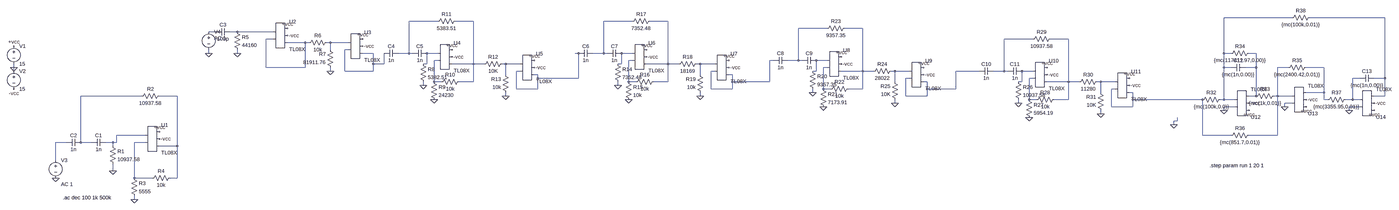
[diagram p0: schematic Filtro_Completo.asc, whole sheet]
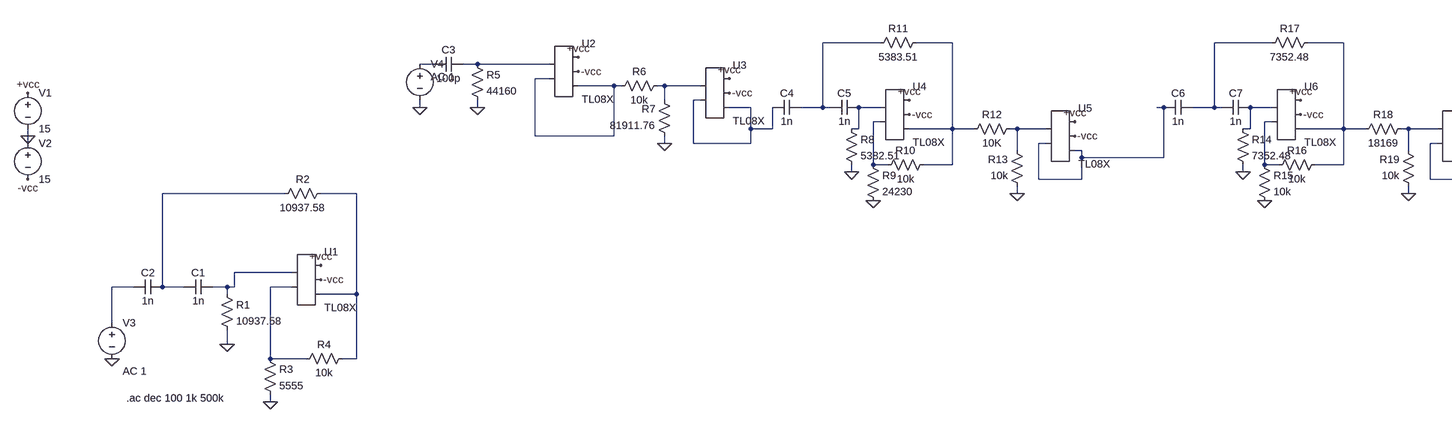
[diagram p1: schematic Filtro_Completo.asc, part, row 1 of 1, column 1 of 2]
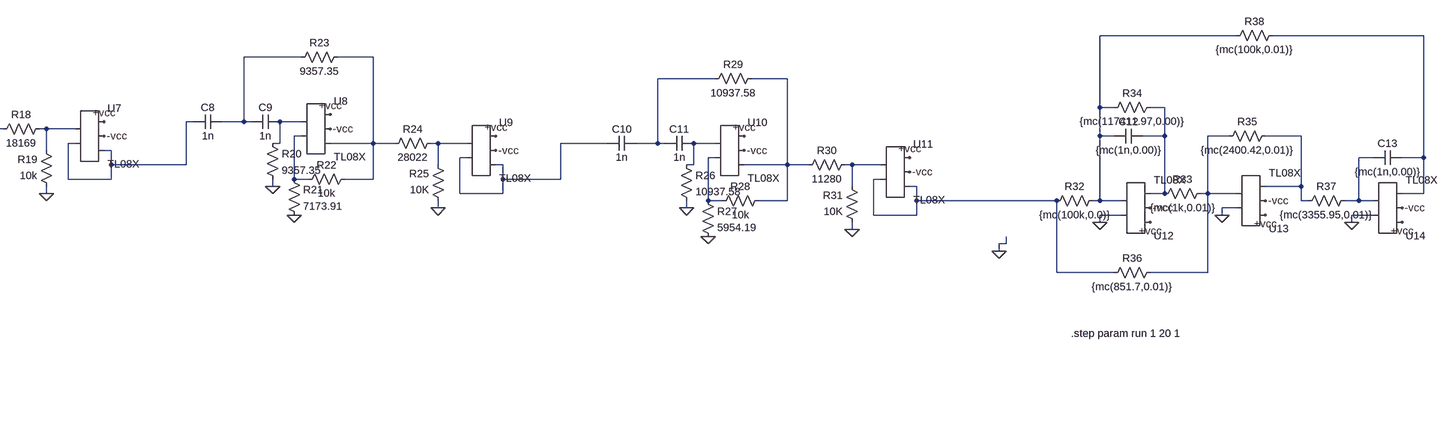
[diagram p2: schematic Filtro_Completo.asc, part, row 1 of 1, column 2 of 2]
Filtro_Completo.asc, the LTspice schematic file:
Version 4
SHEET 1 6904 680
WIRE 6256 -432 5952 -432
WIRE 6672 -432 6336 -432
WIRE 1472 -416 1344 -416
WIRE 1632 -416 1552 -416
WIRE 2464 -416 2336 -416
WIRE 2624 -416 2544 -416
WIRE 3360 -384 3232 -384
WIRE 3520 -384 3440 -384
WIRE 480 -368 448 -368
WIRE 576 -368 544 -368
WIRE 736 -368 576 -368
WIRE 736 -336 704 -336
WIRE 4352 -336 4224 -336
WIRE 4512 -336 4432 -336
WIRE 880 -320 800 -320
WIRE 896 -320 880 -320
WIRE 992 -320 976 -320
WIRE 1072 -320 992 -320
WIRE 992 -288 992 -320
WIRE 1072 -288 1056 -288
WIRE 448 -272 448 -288
WIRE 576 -272 576 -288
WIRE 1184 -272 1136 -272
WIRE 1344 -272 1344 -416
WIRE 1344 -272 1296 -272
WIRE 1360 -272 1344 -272
WIRE 1472 -272 1424 -272
WIRE 2224 -272 2208 -272
WIRE 2336 -272 2336 -416
WIRE 2336 -272 2288 -272
WIRE 2352 -272 2336 -272
WIRE 2464 -272 2416 -272
WIRE 5952 -272 5952 -432
WIRE 5984 -272 5952 -272
WIRE 6096 -272 6064 -272
WIRE 1472 -240 1456 -240
WIRE 2464 -240 2448 -240
WIRE 3120 -240 3104 -240
WIRE 3232 -240 3232 -384
WIRE 3232 -240 3184 -240
WIRE 3248 -240 3232 -240
WIRE 3360 -240 3312 -240
WIRE 1184 -224 1184 -272
WIRE 1232 -224 1232 -272
WIRE 1232 -224 1184 -224
WIRE 1424 -224 1424 -272
WIRE 1424 -224 1408 -224
WIRE 1632 -224 1632 -416
WIRE 1632 -224 1536 -224
WIRE 1680 -224 1632 -224
WIRE 1776 -224 1760 -224
WIRE 1840 -224 1776 -224
WIRE 2416 -224 2416 -272
WIRE 2416 -224 2400 -224
WIRE 2624 -224 2624 -416
WIRE 2624 -224 2528 -224
WIRE 2672 -224 2624 -224
WIRE 2768 -224 2752 -224
WIRE 2832 -224 2768 -224
WIRE -672 -208 -672 -224
WIRE 704 -208 704 -336
WIRE 880 -208 880 -320
WIRE 880 -208 704 -208
WIRE 3360 -208 3344 -208
WIRE 5952 -208 5952 -272
WIRE 5984 -208 5952 -208
WIRE 6096 -208 6096 -272
WIRE 6096 -208 6048 -208
WIRE 6240 -208 6192 -208
WIRE 6400 -208 6320 -208
WIRE -672 -192 -672 -208
WIRE 992 -192 992 -208
WIRE 1056 -192 1056 -288
WIRE 1184 -192 1184 -224
WIRE 1184 -192 1056 -192
WIRE 1840 -192 1824 -192
WIRE 2832 -192 2816 -192
WIRE 3312 -192 3312 -240
WIRE 3312 -192 3296 -192
WIRE 3520 -192 3520 -384
WIRE 3520 -192 3424 -192
WIRE 3568 -192 3520 -192
WIRE 3664 -192 3648 -192
WIRE 3728 -192 3664 -192
WIRE 4112 -192 3936 -192
WIRE 4224 -192 4224 -336
WIRE 4224 -192 4176 -192
WIRE 4240 -192 4224 -192
WIRE 4352 -192 4304 -192
WIRE 1776 -176 1776 -224
WIRE 1920 -176 1904 -176
WIRE 2768 -176 2768 -224
WIRE 2912 -176 2896 -176
WIRE 1920 -160 1920 -176
WIRE 2224 -160 2224 -272
WIRE 2224 -160 1920 -160
WIRE 3728 -160 3712 -160
WIRE 4352 -160 4336 -160
WIRE 6560 -160 6528 -160
WIRE 6672 -160 6672 -432
WIRE 6672 -160 6624 -160
WIRE 1456 -144 1456 -240
WIRE 1488 -144 1456 -144
WIRE 1632 -144 1632 -224
WIRE 1632 -144 1568 -144
WIRE 2448 -144 2448 -240
WIRE 2480 -144 2448 -144
WIRE 2624 -144 2624 -224
WIRE 2624 -144 2560 -144
WIRE 2912 -144 2912 -176
WIRE 3104 -144 3104 -240
WIRE 3104 -144 2912 -144
WIRE 3664 -144 3664 -192
WIRE 3808 -144 3792 -144
WIRE 4304 -144 4304 -192
WIRE 4304 -144 4288 -144
WIRE 4512 -144 4512 -336
WIRE 4512 -144 4416 -144
WIRE 4560 -144 4512 -144
WIRE 4656 -144 4640 -144
WIRE 4720 -144 4656 -144
WIRE 1408 -128 1408 -144
WIRE 2400 -128 2400 -144
WIRE 1824 -112 1824 -192
WIRE 1920 -112 1920 -160
WIRE 1920 -112 1824 -112
WIRE 2816 -112 2816 -192
WIRE 2912 -112 2912 -144
WIRE 2912 -112 2816 -112
WIRE 3344 -112 3344 -208
WIRE 3376 -112 3344 -112
WIRE 3520 -112 3520 -192
WIRE 3520 -112 3456 -112
WIRE 3808 -112 3808 -144
WIRE 3936 -112 3936 -192
WIRE 3936 -112 3808 -112
WIRE 4720 -112 4704 -112
WIRE 3296 -96 3296 -112
WIRE 4656 -96 4656 -144
WIRE 4800 -96 4784 -96
WIRE 6400 -96 6400 -208
WIRE 6400 -96 6320 -96
WIRE 64 -80 -208 -80
WIRE 224 -80 144 -80
WIRE 1776 -80 1776 -96
WIRE 2768 -80 2768 -96
WIRE 3712 -80 3712 -160
WIRE 3808 -80 3808 -112
WIRE 3808 -80 3712 -80
WIRE 6096 -80 6096 -208
WIRE 6096 -80 6064 -80
WIRE 6192 -80 6192 -208
WIRE 6192 -80 6176 -80
WIRE 6256 -80 6192 -80
WIRE 6672 -80 6672 -160
WIRE 6672 -80 6624 -80
WIRE 4336 -64 4336 -160
WIRE 4368 -64 4336 -64
WIRE 4512 -64 4512 -144
WIRE 4512 -64 4448 -64
WIRE 4800 -64 4800 -96
WIRE 5856 -64 4800 -64
WIRE 5952 -64 5952 -208
WIRE 5952 -64 5936 -64
WIRE 6000 -64 5952 -64
WIRE 6400 -64 6400 -96
WIRE 6416 -64 6400 -64
WIRE 6528 -64 6528 -160
WIRE 6528 -64 6496 -64
WIRE 6560 -64 6528 -64
WIRE 3664 -48 3664 -64
WIRE 4288 -48 4288 -64
WIRE 6256 -48 6224 -48
WIRE 4704 -32 4704 -112
WIRE 4800 -32 4800 -64
WIRE 4800 -32 4704 -32
WIRE 6000 -32 5952 -32
WIRE 6224 -32 6224 -48
WIRE 6560 -32 6512 -32
WIRE 5952 -16 5952 -32
WIRE 6512 -16 6512 -32
WIRE 4656 0 4656 -16
WIRE 5744 32 5744 16
WIRE 5744 32 5728 32
WIRE 5728 48 5728 32
WIRE 80 96 -48 96
WIRE 5856 96 5856 -64
WIRE 5984 96 5856 96
WIRE 6192 96 6192 -80
WIRE 6192 96 6064 96
WIRE -272 128 -320 128
WIRE -208 128 -208 -80
WIRE -160 128 -208 128
WIRE -64 128 -96 128
WIRE -48 128 -48 96
WIRE -48 128 -64 128
WIRE 80 128 32 128
WIRE -64 144 -64 128
WIRE 224 144 224 -80
WIRE 224 144 144 144
WIRE -320 208 -320 128
WIRE -64 256 -64 224
WIRE 32 288 32 128
WIRE 112 288 32 288
WIRE 224 288 224 144
WIRE 224 288 192 288
WIRE 32 384 32 368
FLAG -672 -208 0
FLAG -672 -304 +vcc
FLAG -672 -112 -vcc
FLAG -64 256 0
FLAG -320 288 0
FLAG 144 80 +vcc
FLAG 144 112 -vcc
FLAG 32 384 0
FLAG 576 -272 0
FLAG 448 -272 0
FLAG 800 -384 +vcc
FLAG 800 -352 -vcc
FLAG 992 -192 0
FLAG 1136 -336 +vcc
FLAG 1136 -304 -vcc
FLAG 1776 -80 0
FLAG 1408 -128 0
FLAG 1456 -64 0
FLAG 1536 -288 +vcc
FLAG 1536 -256 -vcc
FLAG 1904 -240 +vcc
FLAG 1904 -208 -vcc
FLAG 2768 -80 0
FLAG 2400 -128 0
FLAG 2448 -64 0
FLAG 2528 -288 +vcc
FLAG 2528 -256 -vcc
FLAG 2896 -240 +vcc
FLAG 2896 -208 -vcc
FLAG 3664 -48 0
FLAG 3296 -96 0
FLAG 3344 -32 0
FLAG 3424 -256 +vcc
FLAG 3424 -224 -vcc
FLAG 3792 -208 +vcc
FLAG 3792 -176 -vcc
FLAG 4656 0 0
FLAG 4288 -48 0
FLAG 4336 16 0
FLAG 4416 -208 +vcc
FLAG 4416 -176 -vcc
FLAG 4784 -160 +vcc
FLAG 4784 -128 -vcc
FLAG 5952 -16 0
FLAG 6224 -32 0
FLAG 6512 -16 0
FLAG 6064 -16 +vcc
FLAG 6320 -32 +vcc
FLAG 6624 -16 +vcc
FLAG 6064 -48 -vcc
FLAG 6320 -64 -vcc
FLAG 6624 -48 -vcc
FLAG 5728 48 0
DATAFLAG 6400 -176 ""
SYMBOL AutoGenerated\\TL08X 112 112 R0
SYMATTR InstName U1
SYMBOL voltage -672 -320 R0
WINDOW 123 0 0 Left 0
WINDOW 39 0 0 Left 0
SYMATTR InstName V1
SYMATTR Value 15
SYMBOL voltage -672 -208 R0
WINDOW 123 0 0 Left 0
WINDOW 39 0 0 Left 0
SYMATTR InstName V2
SYMATTR Value 15
SYMBOL res -80 128 R0
SYMATTR InstName R1
SYMATTR Value 10937.58
SYMBOL res 160 -96 R90
WINDOW 0 0 56 VBottom 2
WINDOW 3 32 56 VTop 2
SYMATTR InstName R2
SYMATTR Value 10937.58
SYMBOL cap -96 112 R90
WINDOW 0 0 32 VBottom 2
WINDOW 3 32 32 VTop 2
SYMATTR InstName C1
SYMATTR Value 1n
SYMBOL cap -208 112 R90
WINDOW 0 0 32 VBottom 2
WINDOW 3 32 32 VTop 2
SYMATTR InstName C2
SYMATTR Value 1n
SYMBOL voltage -320 192 R0
WINDOW 123 24 124 Left 2
WINDOW 39 0 0 Left 0
SYMATTR Value2 AC 1
SYMATTR InstName V3
SYMATTR Value ""
SYMBOL res 16 272 R0
SYMATTR InstName R3
SYMATTR Value 5555
SYMBOL res 208 272 R90
WINDOW 0 0 56 VBottom 2
WINDOW 3 32 56 VTop 2
SYMATTR InstName R4
SYMATTR Value 10k
SYMBOL cap 544 -384 R90
WINDOW 0 0 32 VBottom 2
WINDOW 3 32 32 VTop 2
SYMATTR InstName C3
SYMATTR Value 100p
SYMBOL res 560 -384 R0
SYMATTR InstName R5
SYMATTR Value 44160
SYMBOL AutoGenerated\\TL08X 768 -352 R0
SYMATTR InstName U2
SYMBOL voltage 448 -384 R0
WINDOW 123 24 44 Left 2
WINDOW 39 0 0 Left 0
SYMATTR Value2 AC 1
SYMATTR InstName V4
SYMATTR Value ""
SYMBOL res 992 -336 R90
WINDOW 0 0 56 VBottom 2
WINDOW 3 32 56 VTop 2
SYMATTR InstName R6
SYMATTR Value 10k
SYMBOL res 1008 -192 R180
WINDOW 0 36 76 Left 2
WINDOW 3 36 40 Left 2
SYMATTR InstName R7
SYMATTR Value 81911.76
SYMBOL AutoGenerated\\TL08X 1104 -304 R0
SYMATTR InstName U3
SYMBOL AutoGenerated\\TL08X 1504 -256 R0
SYMATTR InstName U4
SYMBOL cap 1296 -288 R90
WINDOW 0 0 32 VBottom 2
WINDOW 3 32 32 VTop 2
SYMATTR InstName C4
SYMATTR Value 1n
SYMBOL cap 1424 -288 R90
WINDOW 0 0 32 VBottom 2
WINDOW 3 32 32 VTop 2
SYMATTR InstName C5
SYMATTR Value 1n
SYMBOL res 1392 -240 R0
SYMATTR InstName R8
SYMATTR Value 5382.51
SYMBOL res 1440 -160 R0
SYMATTR InstName R9
SYMATTR Value 24230
SYMBOL res 1584 -160 R90
WINDOW 0 0 56 VBottom 2
WINDOW 3 32 56 VTop 2
SYMATTR InstName R10
SYMATTR Value 10k
SYMBOL res 1568 -432 R90
WINDOW 0 0 56 VBottom 2
WINDOW 3 32 56 VTop 2
SYMATTR InstName R11
SYMATTR Value 5383.51
SYMBOL res 1776 -240 R90
WINDOW 0 0 56 VBottom 2
WINDOW 3 32 56 VTop 2
SYMATTR InstName R12
SYMATTR Value 10K
SYMBOL res 1792 -80 R180
WINDOW 0 36 76 Left 2
WINDOW 3 36 40 Left 2
SYMATTR InstName R13
SYMATTR Value 10k
SYMBOL AutoGenerated\\TL08X 1872 -208 R0
SYMATTR InstName U5
SYMBOL AutoGenerated\\TL08X 2496 -256 R0
SYMATTR InstName U6
SYMBOL cap 2288 -288 R90
WINDOW 0 0 32 VBottom 2
WINDOW 3 32 32 VTop 2
SYMATTR InstName C6
SYMATTR Value 1n
SYMBOL cap 2416 -288 R90
WINDOW 0 0 32 VBottom 2
WINDOW 3 32 32 VTop 2
SYMATTR InstName C7
SYMATTR Value 1n
SYMBOL res 2384 -240 R0
SYMATTR InstName R14
SYMATTR Value 7352.48
SYMBOL res 2432 -160 R0
SYMATTR InstName R15
SYMATTR Value 10k
SYMBOL res 2576 -160 R90
WINDOW 0 0 56 VBottom 2
WINDOW 3 32 56 VTop 2
SYMATTR InstName R16
SYMATTR Value 10k
SYMBOL res 2560 -432 R90
WINDOW 0 0 56 VBottom 2
WINDOW 3 32 56 VTop 2
SYMATTR InstName R17
SYMATTR Value 7352.48
SYMBOL res 2768 -240 R90
WINDOW 0 0 56 VBottom 2
WINDOW 3 32 56 VTop 2
SYMATTR InstName R18
SYMATTR Value 18169
SYMBOL res 2784 -80 R180
WINDOW 0 36 76 Left 2
WINDOW 3 36 40 Left 2
SYMATTR InstName R19
SYMATTR Value 10k
SYMBOL AutoGenerated\\TL08X 2864 -208 R0
SYMATTR InstName U7
SYMBOL AutoGenerated\\TL08X 3392 -224 R0
SYMATTR InstName U8
SYMBOL cap 3184 -256 R90
WINDOW 0 0 32 VBottom 2
WINDOW 3 32 32 VTop 2
SYMATTR InstName C8
SYMATTR Value 1n
SYMBOL cap 3312 -256 R90
WINDOW 0 0 32 VBottom 2
WINDOW 3 32 32 VTop 2
SYMATTR InstName C9
SYMATTR Value 1n
SYMBOL res 3280 -208 R0
SYMATTR InstName R20
SYMATTR Value 9357.35
SYMBOL res 3328 -128 R0
SYMATTR InstName R21
SYMATTR Value 7173.91
SYMBOL res 3472 -128 R90
WINDOW 0 0 56 VBottom 2
WINDOW 3 32 56 VTop 2
SYMATTR InstName R22
SYMATTR Value 10k
SYMBOL res 3456 -400 R90
WINDOW 0 0 56 VBottom 2
WINDOW 3 32 56 VTop 2
SYMATTR InstName R23
SYMATTR Value 9357.35
SYMBOL res 3664 -208 R90
WINDOW 0 0 56 VBottom 2
WINDOW 3 32 56 VTop 2
SYMATTR InstName R24
SYMATTR Value 28022
SYMBOL res 3680 -48 R180
WINDOW 0 36 76 Left 2
WINDOW 3 36 40 Left 2
SYMATTR InstName R25
SYMATTR Value 10K
SYMBOL AutoGenerated\\TL08X 3760 -176 R0
SYMATTR InstName U9
SYMBOL AutoGenerated\\TL08X 4384 -176 R0
SYMATTR InstName U10
SYMBOL cap 4176 -208 R90
WINDOW 0 0 32 VBottom 2
WINDOW 3 32 32 VTop 2
SYMATTR InstName C10
SYMATTR Value 1n
SYMBOL cap 4304 -208 R90
WINDOW 0 0 32 VBottom 2
WINDOW 3 32 32 VTop 2
SYMATTR InstName C11
SYMATTR Value 1n
SYMBOL res 4272 -160 R0
SYMATTR InstName R26
SYMATTR Value 10937.58
SYMBOL res 4320 -80 R0
SYMATTR InstName R27
SYMATTR Value 5954.19
SYMBOL res 4464 -80 R90
WINDOW 0 0 56 VBottom 2
WINDOW 3 32 56 VTop 2
SYMATTR InstName R28
SYMATTR Value 10k
SYMBOL res 4448 -352 R90
WINDOW 0 0 56 VBottom 2
WINDOW 3 32 56 VTop 2
SYMATTR InstName R29
SYMATTR Value 10937.58
SYMBOL res 4656 -160 R90
WINDOW 0 0 56 VBottom 2
WINDOW 3 32 56 VTop 2
SYMATTR InstName R30
SYMATTR Value 11280
SYMBOL res 4672 0 R180
WINDOW 0 36 76 Left 2
WINDOW 3 36 40 Left 2
SYMATTR InstName R31
SYMATTR Value 10K
SYMBOL AutoGenerated\\TL08X 4752 -128 R0
SYMATTR InstName U11
SYMBOL AutoGenerated\\TL08X 6032 -48 M180
SYMATTR InstName U12
SYMBOL AutoGenerated\\TL08X 6288 -64 M180
SYMATTR InstName U13
SYMBOL AutoGenerated\\TL08X 6592 -48 M180
SYMATTR InstName U14
SYMBOL res 5952 -80 R90
WINDOW 0 0 56 VBottom 2
WINDOW 3 32 56 VTop 2
SYMATTR InstName R32
SYMATTR Value {mc(100k,0.0)}
SYMBOL res 6192 -96 R90
WINDOW 0 0 56 VBottom 2
WINDOW 3 32 56 VTop 2
SYMATTR InstName R33
SYMATTR Value {mc(1k,0.01)}
SYMBOL res 6080 -288 R90
WINDOW 0 0 56 VBottom 2
WINDOW 3 32 56 VTop 2
SYMATTR InstName R34
SYMATTR Value {mc(117411.97,0.00)}
SYMBOL cap 6048 -224 R90
WINDOW 0 0 32 VBottom 2
WINDOW 3 32 32 VTop 2
SYMATTR InstName C12
SYMATTR Value {mc(1n,0.00)}
SYMBOL res 6336 -224 R90
WINDOW 0 0 56 VBottom 2
WINDOW 3 32 56 VTop 2
SYMATTR InstName R35
SYMATTR Value {mc(2400.42,0.01)}
SYMBOL res 6080 80 R90
WINDOW 0 0 56 VBottom 2
WINDOW 3 32 56 VTop 2
SYMATTR InstName R36
SYMATTR Value {mc(851.7,0.01)}
SYMBOL res 6512 -80 R90
WINDOW 0 0 56 VBottom 2
WINDOW 3 32 56 VTop 2
SYMATTR InstName R37
SYMATTR Value {mc(3355.95,0.01)}
SYMBOL cap 6624 -176 R90
WINDOW 0 0 32 VBottom 2
WINDOW 3 32 32 VTop 2
SYMATTR InstName C13
SYMATTR Value {mc(1n,0.00)}
SYMBOL res 6352 -448 R90
WINDOW 0 0 56 VBottom 2
WINDOW 3 32 56 VTop 2
SYMATTR InstName R38
SYMATTR Value {mc(100k,0.01)}
TEXT -288 376 Left 2 !.ac dec 100 1k 500k
TEXT 5888 232 Left 2 !.step param run 1 20 1

The netlist it stands for:
* Filtro_Completo.asc
* U1: TL08X (symbol AutoGenerated\TL08X not available, pins judged from their places): pin1=N038 pin2=N040 pin3=+vcc pin4=-vcc pin5=N037
V1 +vcc 0 15
V2 0 -vcc 15
R1 N038 0 10937.58
R2 N037 N036 10937.58
C1 N038 N036 1n
C2 N036 N039 1n
V3 N039 0 AC 1
R3 N040 0 5555
R4 N037 N040 10k
C3 N010 N009 100p
R5 N010 0 44160
* U2: TL08X (symbol AutoGenerated\TL08X not available, pins judged from their places): pin1=N010 pin2=N011 pin3=+vcc pin4=-vcc pin5=N011
V4 N009 0 AC 1
R6 N014 N011 10k
R7 0 N014 81911.76
* U3: TL08X (symbol AutoGenerated\TL08X not available, pins judged from their places): pin1=N014 pin2=N015 pin3=+vcc pin4=-vcc pin5=N015
* U4: TL08X (symbol AutoGenerated\TL08X not available, pins judged from their places): pin1=N016 pin2=N020 pin3=+vcc pin4=-vcc pin5=N004
C4 N003 N015 1n
C5 N016 N003 1n
R8 N016 0 5382.51
R9 N020 0 24230
R10 N004 N020 10k
R11 N004 N003 5383.51
R12 N024 N004 10K
R13 0 N024 10k
* U5: TL08X (symbol AutoGenerated\TL08X not available, pins judged from their places): pin1=N024 pin2=N017 pin3=+vcc pin4=-vcc pin5=N017
* U6: TL08X (symbol AutoGenerated\TL08X not available, pins judged from their places): pin1=N018 pin2=N021 pin3=+vcc pin4=-vcc pin5=N006
C6 N005 N017 1n
C7 N018 N005 1n
R14 N018 0 7352.48
R15 N021 0 10k
R16 N006 N021 10k
R17 N006 N005 7352.48
R18 N025 N006 18169
R19 0 N025 10k
* U7: TL08X (symbol AutoGenerated\TL08X not available, pins judged from their places): pin1=N025 pin2=N022 pin3=+vcc pin4=-vcc pin5=N022
* U8: TL08X (symbol AutoGenerated\TL08X not available, pins judged from their places): pin1=N023 pin2=N026 pin3=+vcc pin4=-vcc pin5=N008
C8 N007 N022 1n
C9 N023 N007 1n
R20 N023 0 9357.35
R21 N026 0 7173.91
R22 N008 N026 10k
R23 N008 N007 9357.35
R24 N029 N008 28022
R25 0 N029 10K
* U9: TL08X (symbol AutoGenerated\TL08X not available, pins judged from their places): pin1=N029 pin2=N030 pin3=+vcc pin4=-vcc pin5=N030
* U10: TL08X (symbol AutoGenerated\TL08X not available, pins judged from their places): pin1=N031 pin2=N032 pin3=+vcc pin4=-vcc pin5=N013
C10 N012 N030 1n
C11 N031 N012 1n
R26 N031 0 10937.58
R27 N032 0 5954.19
R28 N013 N032 10k
R29 N013 N012 10937.58
R30 N034 N013 11280
R31 0 N034 10K
* U11: TL08X (symbol AutoGenerated\TL08X not available, pins judged from their places): pin1=N034 pin2=N035 pin3=+vcc pin4=-vcc pin5=N035
* U12: TL08X (symbol AutoGenerated\TL08X not available, pins judged from their places): pin1=0 pin2=N001 pin3=+vcc pin4=-vcc pin5=N019
* U13: TL08X (symbol AutoGenerated\TL08X not available, pins judged from their places): pin1=0 pin2=N027 pin3=+vcc pin4=-vcc pin5=N028
* U14: TL08X (symbol AutoGenerated\TL08X not available, pins judged from their places): pin1=0 pin2=N033 pin3=+vcc pin4=-vcc pin5=N002
R32 N001 N035 {mc(100k,0.0)}
R33 N027 N019 {mc(1k,0.01)}
R34 N019 N001 {mc(117411.97,0.00)}
C12 N019 N001 {mc(1n,0.00)}
R35 N028 N027 {mc(2400.42,0.01)}
R36 N027 N035 {mc(851.7,0.01)}
R37 N033 N028 {mc(3355.95,0.01)}
C13 N002 N033 {mc(1n,0.00)}
R38 N002 N001 {mc(100k,0.01)}
.ac dec 100 1k 500k
.step param run 1 20 1
.backanno
.end